# EAGLE schematic cadiz_mb_20140331_6 (EAGLE 6.1)
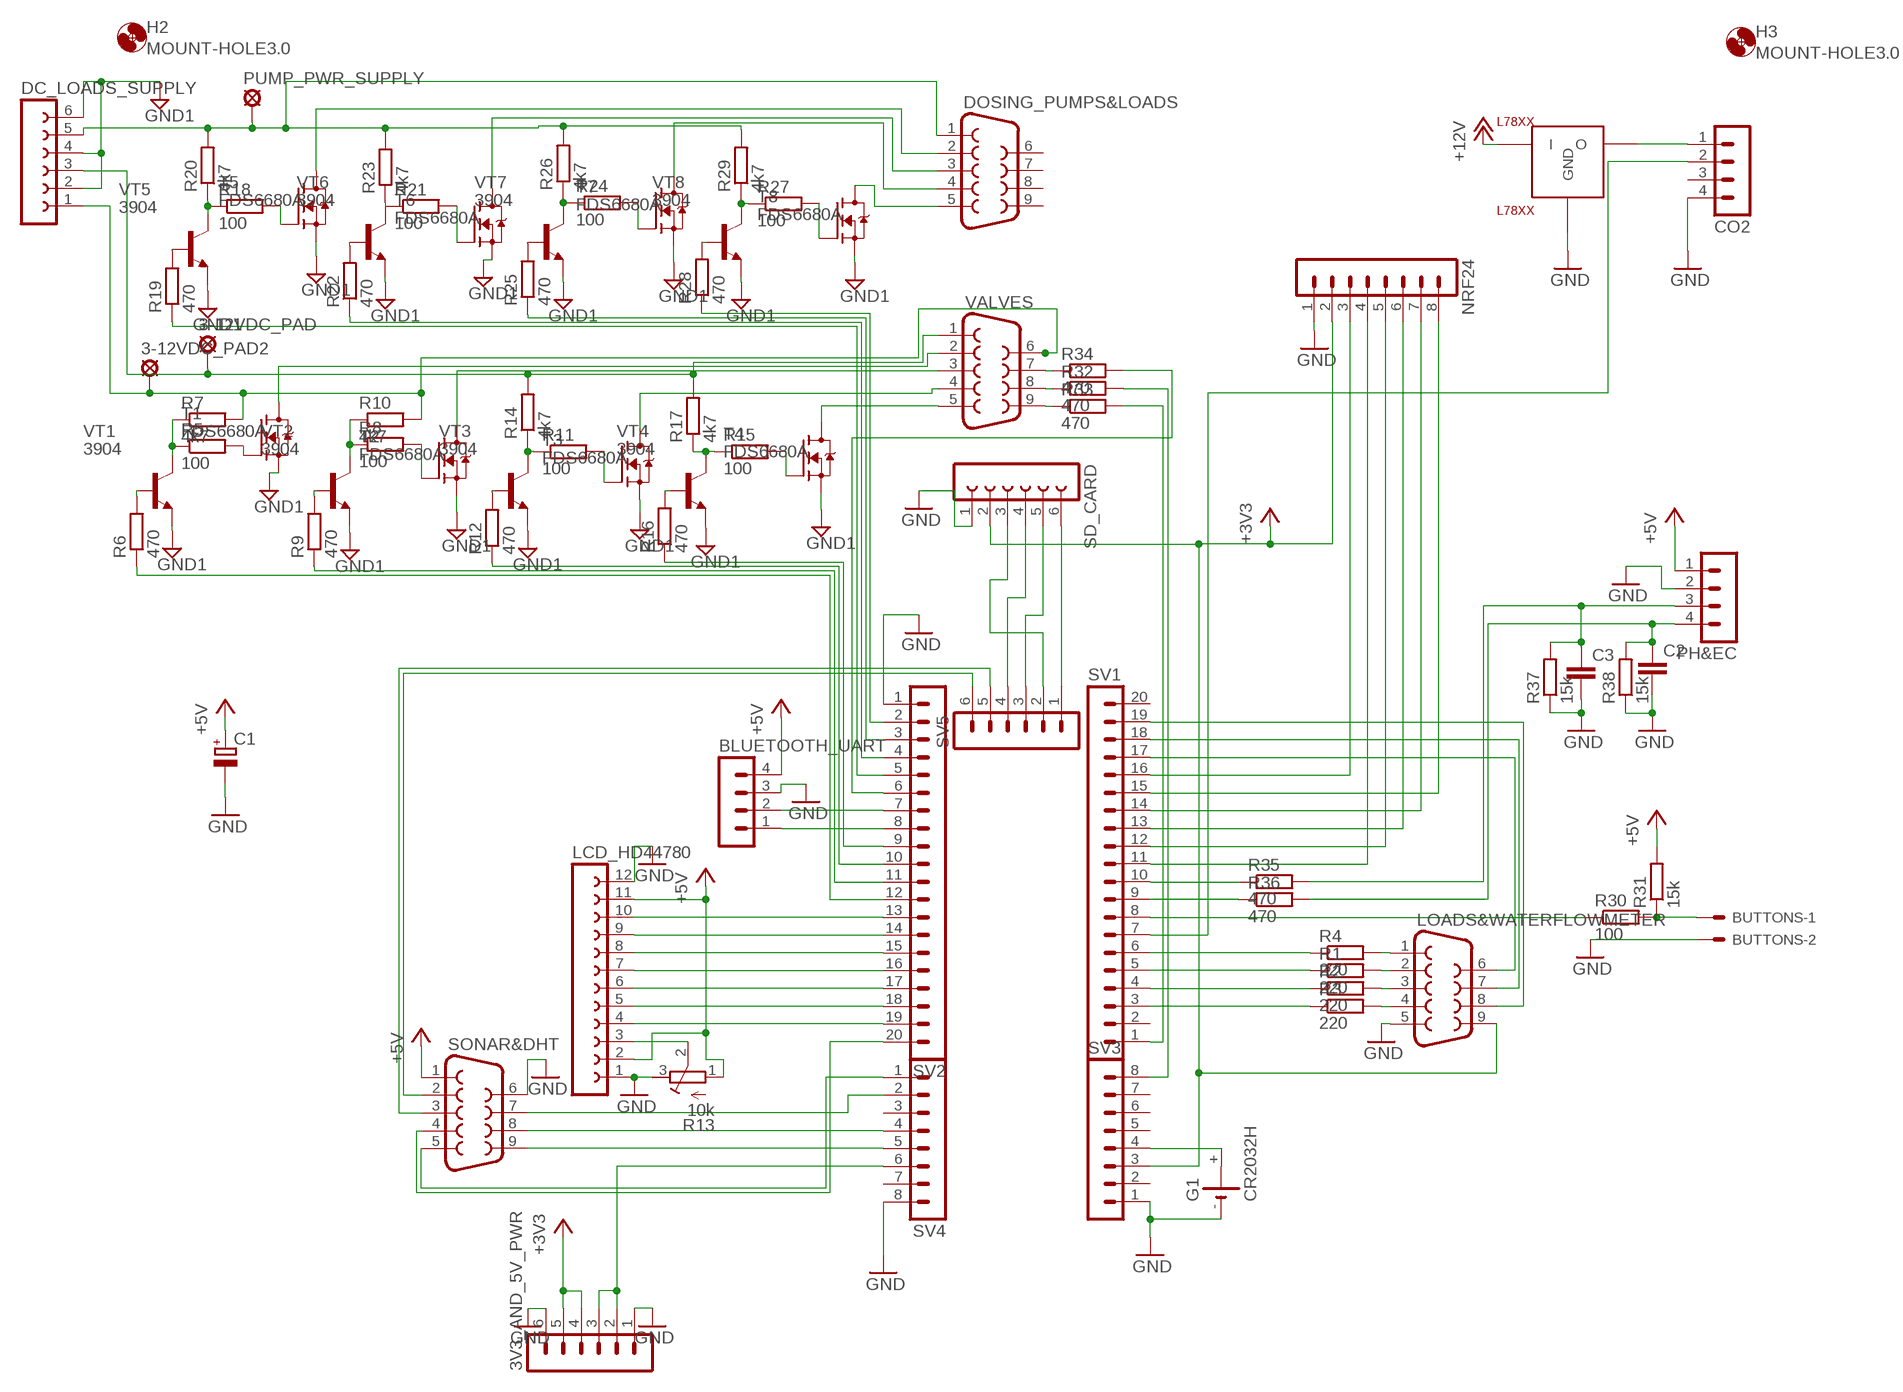
[diagram p0: schematic, sheet 1]

## Parts
3-12VDC_PAD  LSP13  [LSP13]
3-12VDC_PAD2  LSP13  [LSP13]
3V3_AND_5V_PWR  MA06-1  [MA06-1]
BLUETOOTH_UART  MA04-1  [MA04-1]
BUTTONS  22-23-2021  [22-23-2021]
C1  CPOL-EUE5-13  [E5-13]
C2  C-EUC1206  [C1206]
C3  C-EUC1206  [C1206]
CO2  MA04-1  [MA04-1]
DC_LOADS_SUPPLY  FE06-1  [FE06]
DOSING_PUMPS&LOADS  F09HP  [F09HP]
G1  CR2032H  [CR2032H]
H2  MOUNT-HOLE3.0  [3,0]
H3  MOUNT-HOLE3.0  [3,0]
L7806  L78XX  [TO220]
LCD_HD44780  FE12-1  [FE12]
LOADS&WATERFLOWMETER  F09HP  [F09HP]
NRF24  MA08-1  [MA08-1]
PH&EC  MA04-1  [MA04-1]
PUMP_PWR_SUPPLY  LSP13  [LSP13]
R1  220  R-EU_M1206  [M1206]
R2  220  R-EU_M1206  [M1206]
R3  220  R-EU_M1206  [M1206]
R4  220  R-EU_M1206  [M1206]
R5  100  R-EU_M1206  [M1206]
R6  470  R-EU_M1206  [M1206]
R7  4k7  R-EU_M1206  [M1206]
R8  100  R-EU_M1206  [M1206]
R9  470  R-EU_M1206  [M1206]
R10  4k7  R-EU_M1206  [M1206]
R11  100  R-EU_M1206  [M1206]
R12  470  R-EU_M1206  [M1206]
R13  10k  R-TRIMM3374  [RTRIM3374]
R14  4k7  R-EU_M1206  [M1206]
R15  100  R-EU_M1206  [M1206]
R16  470  R-EU_M1206  [M1206]
R17  4k7  R-EU_M1206  [M1206]
R18  100  R-EU_M1206  [M1206]
R19  470  R-EU_M1206  [M1206]
R20  4k7  R-EU_M1206  [M1206]
R21  100  R-EU_M1206  [M1206]
R22  470  R-EU_M1206  [M1206]
R23  4k7  R-EU_M1206  [M1206]
R24  100  R-EU_M1206  [M1206]
R25  470  R-EU_M1206  [M1206]
R26  4k7  R-EU_M1206  [M1206]
R27  100  R-EU_M1206  [M1206]
R28  470  R-EU_M1206  [M1206]
R29  4k7  R-EU_M1206  [M1206]
R30  100  R-EU_M1206  [M1206]
R31  15k  R-EU_M1206  [M1206]
R32  470  R-EU_M1206  [M1206]
R33  470  R-EU_M1206  [M1206]
R34  470  R-EU_M1206  [M1206]
R35  470  R-EU_M1206  [M1206]
R36  470  R-EU_M1206  [M1206]
R37  15k  R-EU_M1206  [M1206]
R38  15k  R-EU_M1206  [M1206]
SD_CARD  FE06-1  [FE06]
SONAR&DHT  F09HP  [F09HP]
SV1  MA20-1  [MA20-1]
SV2  MA20-1  [MA20-1]
SV3  MA08-1  [MA08-1]
SV4  MA08-1  [MA08-1]
SV5  MA06-1  [MA06-1]
T1  FDS6680A  FDS6680A_SOP8  [SO8]
T2  FDS6680A  FDS6680A_SOP8  [SO8]
T3  FDS6680A  FDS6680A_SOP8  [SO8]
T4  FDS6680A  FDS6680A_SOP8  [SO8]
T5  FDS6680A  FDS6680A_SOP8  [SO8]
T6  FDS6680A  FDS6680A_SOP8  [SO8]
T7  FDS6680A  FDS6680A_SOP8  [SO8]
T8  FDS6680A  FDS6680A_SOP8  [SO8]
VALVES  F09HP  [F09HP]
VT1  3904  BC847  [SOT23]
VT2  3904  BC847  [SOT23]
VT3  3904  BC847  [SOT23]
VT4  3904  BC847  [SOT23]
VT5  3904  BC847  [SOT23]
VT6  3904  BC847  [SOT23]
VT7  3904  BC847  [SOT23]
VT8  3904  BC847  [SOT23]

## Nets
+3V3: 3V3_AND_5V_PWR.4 3V3_AND_5V_PWR.5 LOADS&WATERFLOWMETER.9 NRF24.2 SD_CARD.2 SV3.3
+5V: BLUETOOTH_UART.4 C1.+ LCD_HD44780.2 LCD_HD44780.11 PH&EC.1 R13.1(E) R31.2 SONAR&DHT.1
+12V: L7806.IN(I)
GND [1A]: 3V3_AND_5V_PWR.1 3V3_AND_5V_PWR.6 BLUETOOTH_UART.3 BUTTONS.2 C1.- C2.2 C3.2 CO2.4 G1.- L7806.GND LCD_HD44780.1 LCD_HD44780.12 LOADS&WATERFLOWMETER.5 NRF24.1 PH&EC.2 R13.3(A) R37.1 R38.1 SD_CARD.1 SONAR&DHT.6 SV2.1 SV3.1 SV4.8
GND1 [3A]: DC_LOADS_SUPPLY.2 DC_LOADS_SUPPLY.4 DC_LOADS_SUPPLY.6 T1.SOURCE(S) T2.SOURCE(S) T3.SOURCE(S) T4.SOURCE(S) T5.SOURCE(S) T6.SOURCE(S) T7.SOURCE(S) T8.SOURCE(S) VT1.2(E) VT2.2(E) VT3.2(E) VT4.2(E) VT5.2(E) VT6.2(E) VT7.2(E) VT8.2(E)
N$1: NRF24.6 SV1.13
N$2: LCD_HD44780.4 SV2.19
N$3: R16.1 SV2.9
N$4: SONAR&DHT.2 SV5.6
N$5: LCD_HD44780.3 R13.2(S)
N$6: G1.+ SV3.4
N$7: LCD_HD44780.5 SV2.18
N$8: LCD_HD44780.6 SV2.17
N$9: LCD_HD44780.7 SV2.16
N$10: LOADS&WATERFLOWMETER.3 R2.2
N$11: LCD_HD44780.8 SV2.15
N$12: R12.1 SV2.10
N$13: LOADS&WATERFLOWMETER.4 R3.2
N$14: LOADS&WATERFLOWMETER.2 R1.2
N$15: LCD_HD44780.9 SV2.14
N$16: LCD_HD44780.10 SV2.13
N$17: SONAR&DHT.3 SV5.5
N$18: R11.1 R14.1 VT3.3(C)
N$19: SD_CARD.6 SV5.1
N$20: SONAR&DHT.7 SV4.2
N$21: SD_CARD.5 SV5.3
N$22: SD_CARD.4 SV5.4
N$23: SONAR&DHT.8 SV4.4
N$24: SD_CARD.3 SV5.2
N$26: R1.1 SV1.5
N$27: R2.1 SV1.4
N$28: R3.1 SV1.3
N$29: R4.1 SV1.6
N$30: SONAR&DHT.9 SV4.5
N$31: LOADS&WATERFLOWMETER.1 R4.2
N$32: R8.2 T2.GATE(G)
N$33: R5.2 T1.GATE(G)
N$34: R6.2 VT1.1(B)
N$35: R9.2 VT2.1(B)
N$36 [1A]: 3V3_AND_5V_PWR.2 3V3_AND_5V_PWR.3 SV4.6
N$37: R11.2 T3.GATE(G)
N$38: R12.2 VT3.1(B)
N$39: R15.2 T4.GATE(G)
N$40: R16.2 VT4.1(B)
N$41: R18.2 T5.GATE(G)
N$42: R19.2 VT5.1(B)
N$43: R21.2 T6.GATE(G)
N$44: R22.2 VT6.1(B)
N$45: R24.2 T7.GATE(G)
N$46: R25.2 VT7.1(B)
N$47: R27.2 T8.GATE(G)
N$48: R28.2 VT8.1(B)
N$49 [3A]: 3-12VDC_PAD.MP DC_LOADS_SUPPLY.3 R14.2 R17.2 VALVES.1
N$50 [3A]: 3-12VDC_PAD2.MP DC_LOADS_SUPPLY.1 R7.2 R10.2 VALVES.6
N$51: R9.1 SV2.11
N$52: R6.1 SV2.12
N$53 [1A]: DC_LOADS_SUPPLY.5 DOSING_PUMPS&LOADS.1 PUMP_PWR_SUPPLY.MP R20.2 R23.2 R26.2 R29.2
N$54: BLUETOOTH_UART.1 SV2.8
N$55: BLUETOOTH_UART.2 SV2.7
N$56: R28.1 SV2.2
N$57: R25.1 SV2.3
N$58: R22.1 SV2.4
N$59: R19.1 SV2.5
N$60 [3A]: DOSING_PUMPS&LOADS.5 T8.DRAIN(D)
N$61 [3A]: DOSING_PUMPS&LOADS.4 T7.DRAIN(D)
N$62 [3A]: DOSING_PUMPS&LOADS.3 T6.DRAIN(D)
N$63 [3A]: DOSING_PUMPS&LOADS.2 T5.DRAIN(D)
N$64: BUTTONS.1 R30.2 R31.1
N$65: NRF24.7 SV1.14
N$66: NRF24.5 SV1.12
N$67: R30.1 SV1.8
N$68: T4.DRAIN(D) VALVES.5
N$69: T3.DRAIN(D) VALVES.4
N$70 [3A]: T2.DRAIN(D) VALVES.3
N$71 [3A]: T1.DRAIN(D) VALVES.2
N$72: R32.1 VALVES.8
N$73: R33.1 VALVES.9
N$74: R34.1 VALVES.7
N$75: LOADS&WATERFLOWMETER.7 SV1.18
N$76: LOADS&WATERFLOWMETER.8 SV1.19
N$77: LOADS&WATERFLOWMETER.6 SV1.17
N$78: SONAR&DHT.5 SV4.1
N$79: SONAR&DHT.4 SV2.20
N$80: NRF24.4 SV1.11
N$81: NRF24.8 SV1.15
N$82: NRF24.3 SV1.16
N$83: R33.2 SV1.1
N$84: R32.2 SV3.8
N$85: R34.2 SV2.6
N$86: C2.1 PH&EC.4 R36.2 R38.2
N$87: C3.1 PH&EC.3 R35.2 R37.2
N$88: R35.1 SV1.10
N$89: R36.1 SV1.9
N$90: CO2.1 L7806.OUT(O)
N$91: CO2.2 SV1.7
VT1: R5.1 R7.1 VT1.3(C)
VT2: R8.1 R10.1 VT2.3(C)
VT4: R15.1 R17.1 VT4.3(C)
VT5: R18.1 R20.1 VT5.3(C)
VT6: R21.1 R23.1 VT6.3(C)
VT7: R24.1 R26.1 VT7.3(C)
VT8: R27.1 R29.1 VT8.3(C)
Unconnected: CO2.3 DOSING_PUMPS&LOADS.6 DOSING_PUMPS&LOADS.7 DOSING_PUMPS&LOADS.8 DOSING_PUMPS&LOADS.9 G1.+@1(+) SV1.2 SV1.20 SV3.2 SV3.5 SV3.6 SV3.7 SV4.3 SV4.7

## Library data of the parts
3-12VDC_PAD 3-12VDC_PAD2 PUMP_PWR_SUPPLY = solpad:LSP13: SOLDER PAD drill 1.3 mm, distributor Buerklin, 12H562
3V3_AND_5V_PWR SV5 = con-lstb:MA06-1: PIN HEADER; OC_FARNELL: unknown; OC_NEWARK: unknown
BLUETOOTH_UART CO2 PH&EC = con-lstb:MA04-1: PIN HEADER; OC_FARNELL: unknown; OC_NEWARK: unknown
BUTTONS = con-molex:22-23-2021: .100" (2.54mm) Center Header - 2 Pin; MF: MOLEX; MPN: 22-23-2021; OC_FARNELL: 1462926; OC_NEWARK: 25C3832
C1 = rcl:CPOL-EU: POLARIZED CAPACITOR, European symbol
C2 C3 = resistor:C-EU: CAPACITOR, European symbol
DC_LOADS_SUPPLY SD_CARD = con-lsta:FE06-1: FEMALE HEADER; OC_FARNELL: unknown; OC_NEWARK: unknown
DOSING_PUMPS&LOADS LOADS&WATERFLOWMETER SONAR&DHT VALVES = con-subd:F09: SUB-D; OC_FARNELL: unknown; OC_NEWARK: unknown
G1 = battery:CR2032H: LI BATTERY Varta
H2 H3 = holes:MOUNT-HOLE: MOUNTING HOLE with drill center marker
L7806 = L78xx:L78XX
LCD_HD44780 = con-lsta:FE12-1: FEMALE HEADER; OC_FARNELL: unknown; OC_NEWARK: unknown
NRF24 SV3 SV4 = con-lstb:MA08-1: PIN HEADER; OC_FARNELL: unknown; OC_NEWARK: unknown
R1-R12 R14-R38 = resistor:R-EU_: RESISTOR, European symbol
R13 = resistor:R-TRIMM: Trimm resistor
SV1 SV2 = con-lstb:MA20-1: PIN HEADER; OC_FARNELL: unknown; OC_NEWARK: unknown
T1-T8 = FDS6680A:FDS6680A_SOP8
VT1-VT8 = transistor:BC847: NPN TRANSISTOR

## Net classes
3 1A: width 1 mm, drill 1 mm, clearance 1 mm
4 3A: width 2 mm, drill 1 mm, clearance 1 mm